# EAGLE schematic pulse-generator (EAGLE 7.6.0)

## Sheet 1 of 2
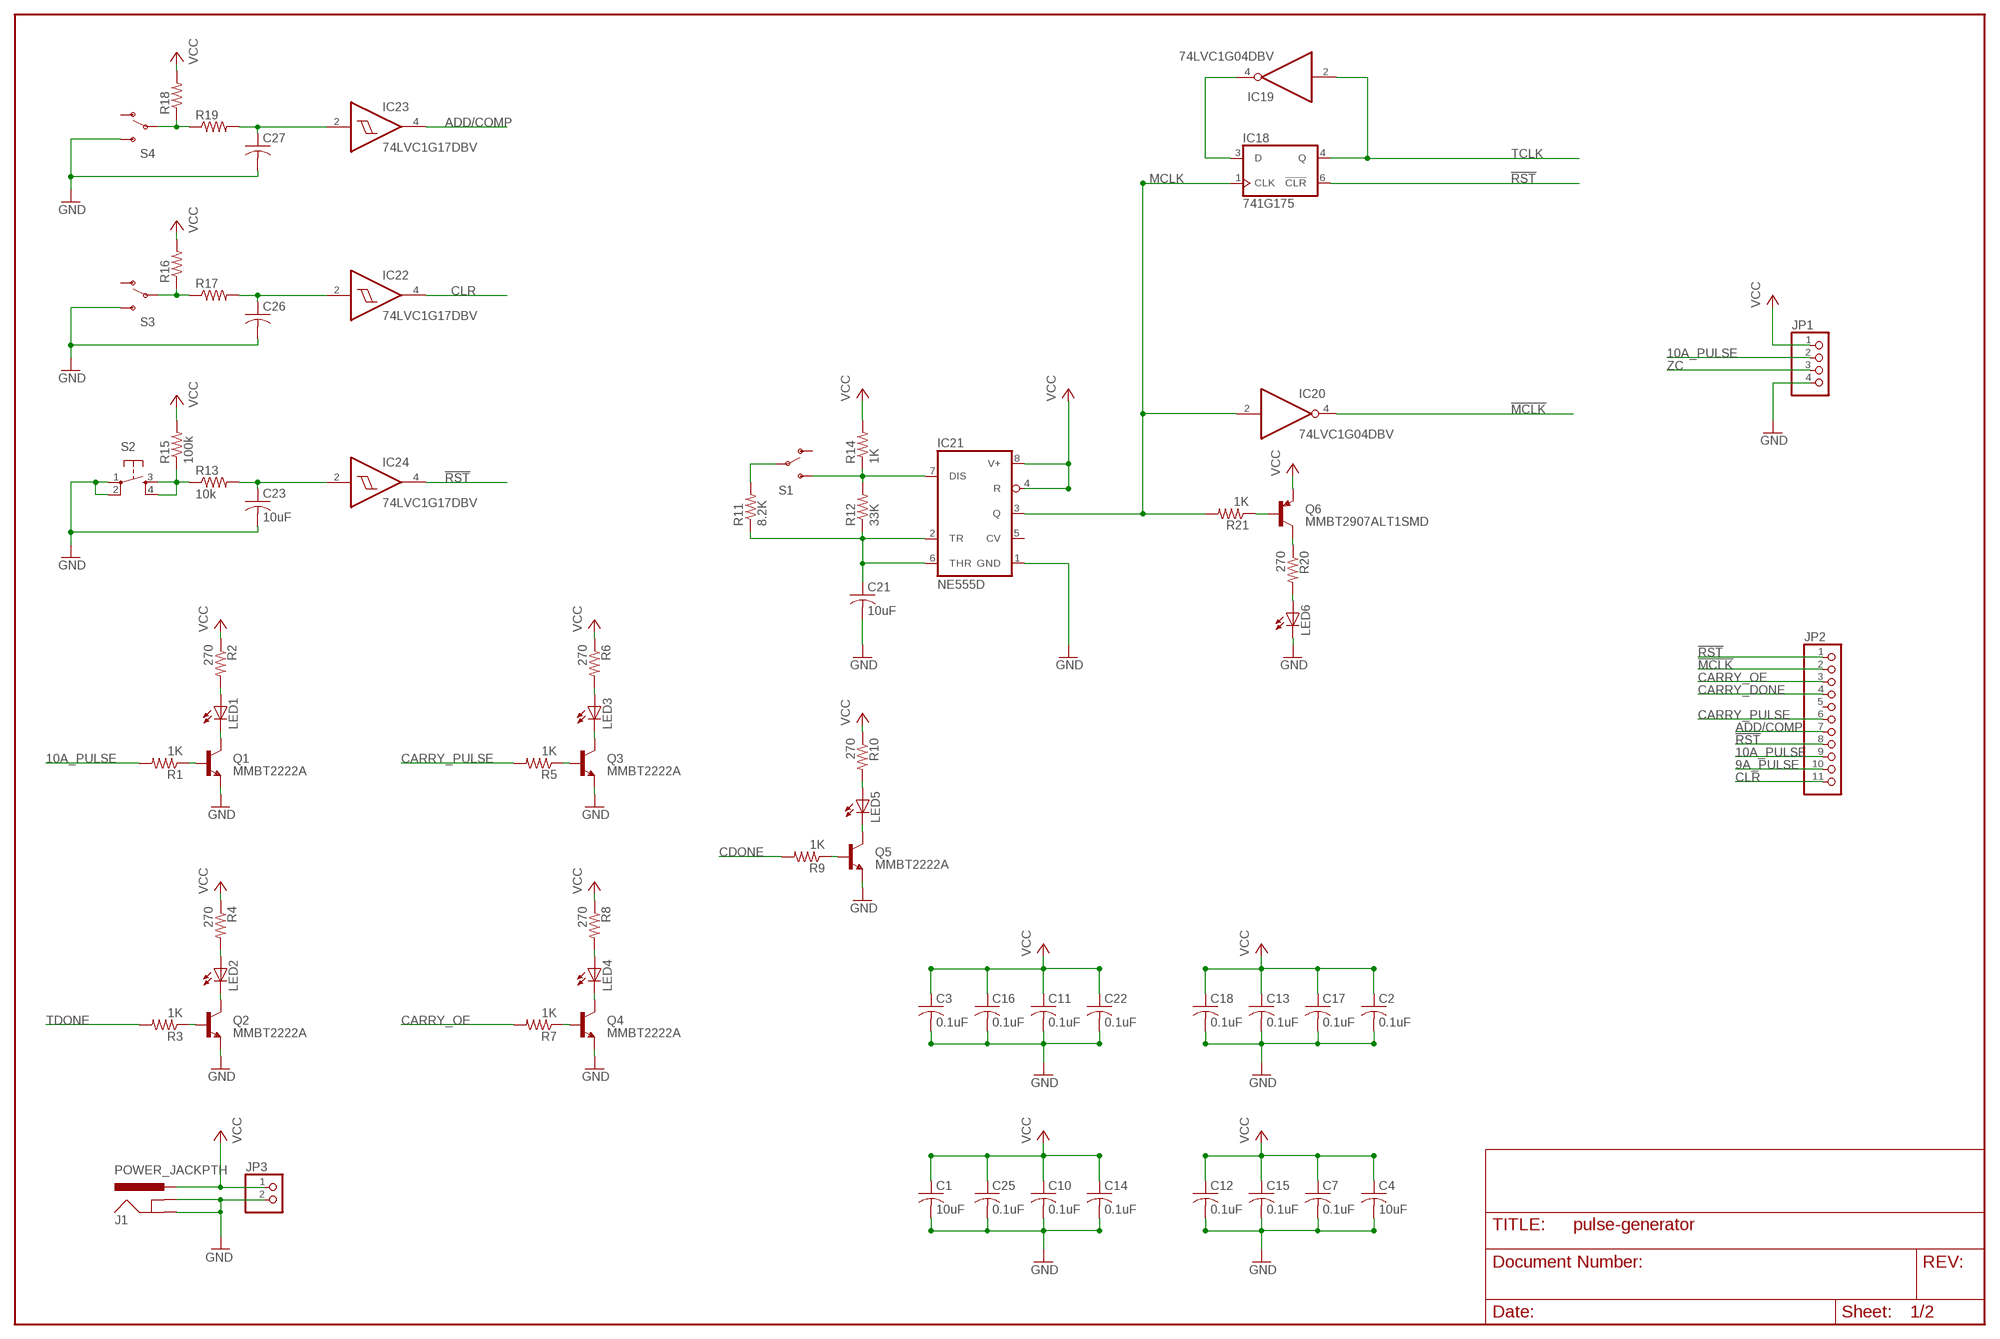
[diagram p0: schematic, sheet 1]

### Parts
C1  10uF  C-USC0805  [C0805]
C2  0.1uF  C-USC0805  [C0805]
C3  0.1uF  C-USC0805  [C0805]
C4  10uF  C-USC0805  [C0805]
C7  0.1uF  C-USC0805  [C0805]
C10  0.1uF  C-USC0805  [C0805]
C11  0.1uF  C-USC0805  [C0805]
C12  0.1uF  C-USC0805  [C0805]
C13  0.1uF  C-USC0805  [C0805]
C14  0.1uF  C-USC0805  [C0805]
C15  0.1uF  C-USC0805  [C0805]
C16  0.1uF  C-USC0805  [C0805]
C17  0.1uF  C-USC0805  [C0805]
C18  0.1uF  C-USC0805  [C0805]
C21  10uF  C-USC0805  [C0805]
C22  0.1uF  C-USC0805  [C0805]
C23  10uF  C-USC0805  [C0805]
C25  0.1uF  C-USC0805  [C0805]
C26  C-USC0805  [C0805]
C27  C-USC0805  [C0805]
IC18  741G175  [DBV_R-PDSO-G6]
IC19  74LVC1G04DBV  [SOT23-5]
IC20  74LVC1G04DBV  [SOT23-5]
IC21  NE555D  [SO08]
IC22  74LVC1G17DBV  [SOT23-5]
IC23  74LVC1G17DBV  [SOT23-5]
IC24  74LVC1G17DBV  [SOT23-5]
J1  POWER_JACKPTH  [POWER_JACK_PTH]
JP1  PINHD-1X4  [1X04]
JP2  PINHD-1X11  [1X11]
JP3  PINHD-1X2  [1X02]
LED1  LEDCHIP-LED0805  [CHIP-LED0805]
LED2  LEDCHIP-LED0805  [CHIP-LED0805]
LED3  LEDCHIP-LED0805  [CHIP-LED0805]
LED4  LEDCHIP-LED0805  [CHIP-LED0805]
LED5  LEDCHIP-LED0805  [CHIP-LED0805]
LED6  LEDCHIP-LED0805  [CHIP-LED0805]
Q1  MMBT2222A  TRANSISTOR_NPNMMBT2222A  [SOT23-3]
Q2  MMBT2222A  TRANSISTOR_NPNMMBT2222A  [SOT23-3]
Q3  MMBT2222A  TRANSISTOR_NPNMMBT2222A  [SOT23-3]
Q4  MMBT2222A  TRANSISTOR_NPNMMBT2222A  [SOT23-3]
Q5  MMBT2222A  TRANSISTOR_NPNMMBT2222A  [SOT23-3]
Q6  MMBT2907ALT1SMD  [SOT23-BEC]
R1  1K  R-US_R0805  [R0805]
R2  270  R-US_R0805  [R0805]
R3  1K  R-US_R0805  [R0805]
R4  270  R-US_R0805  [R0805]
R5  1K  R-US_R0805  [R0805]
R6  270  R-US_R0805  [R0805]
R7  1K  R-US_R0805  [R0805]
R8  270  R-US_R0805  [R0805]
R9  1K  R-US_R0805  [R0805]
R10  270  R-US_R0805  [R0805]
R11  8.2K  R-US_R0805  [R0805]
R12  33K  R-US_R0805  [R0805]
R13  10k  R-US_R0805  [R0805]
R14  1K  R-US_R0805  [R0805]
R15  100k  R-US_R0805  [R0805]
R16  R-US_R0805  [R0805]
R17  R-US_R0805  [R0805]
R18  R-US_R0805  [R0805]
R19  R-US_R0805  [R0805]
R20  270  R-US_R0805  [R0805]
R21  1K  R-US_R0805  [R0805]
S1  SWITCH-SPDTPTH  [SWITCH-SPDT]
S2  TAC_SWITCHPTH  [TACTILE-PTH]
S3  SWITCH-SPDTPTH  [SWITCH-SPDT]
S4  SWITCH-SPDTPTH  [SWITCH-SPDT]

### Nets
9A_PULSE: JP2.10 ; also sheet 2
10A_PULSE: JP1.2 JP2.9 R1.2 ; also sheet 2
!MCLK: IC20.4(O) JP2.2 ; also sheet 2
!RST: IC18.6(!CLR) IC24.4(O) JP2.1 JP2.8 ; also sheet 2
ADD/COMP: IC23.4(O) JP2.7
CARRY_DONE: JP2.4 ; also sheet 2
CARRY_OE: JP2.3 R7.2 ; also sheet 2
CARRY_PULSE: JP2.6 R5.2 ; also sheet 2
CDONE: R9.2 ; also sheet 2
CLR: IC22.4(O) JP2.11
GND: C1.2 C2.2 C3.2 C4.2 C7.2 C10.2 C11.2 C12.2 C13.2 C14.2 C15.2 C16.2 C17.2 C18.2 C21.2 C22.2 C23.2 C25.2 C26.2 C27.2 IC21.1(GND) J1.GND J1.GNDBREAK JP1.4 JP3.2 LED6.C Q1.2(E) Q2.2(E) Q3.2(E) Q4.2(E) Q5.2(E) S2.1 S2.2 S3.3(S) S4.3(S) ; also sheet 2
MCLK: IC18.1(CLK) IC20.2(I) IC21.3(Q) R21.2
N$1: IC18.3(D) IC19.4(O)
N$2: C21.1 IC21.2(TR) IC21.6(THR) R11.1 R12.1
N$3: IC21.7(DIS) R12.2 R14.1 S1.3(S)
N$4: R11.2 S1.2(P)
N$5: Q6.B R21.1
N$6: Q6.C R20.1
N$7: LED6.A R20.2
N$10: LED3.C Q3.3(C)
N$13: LED1.C Q1.3(C)
N$19: C23.1 IC24.2(I) R13.2
N$20: R13.1 R15.1 S2.3 S2.4
N$21: C26.1 IC22.2(I) R17.2
N$22: R16.1 R17.1 S3.2(P)
N$24: Q3.1(B) R5.1
N$25: LED3.A R6.2
N$26: Q1.1(B) R1.1
N$28: LED1.A R2.2
N$29: C27.1 IC23.2(I) R19.2
N$30: R18.1 R19.1 S4.2(P)
N$31: LED2.C Q2.3(C)
N$32: Q2.1(B) R3.1
N$33: LED2.A R4.2
N$34: LED4.C Q4.3(C)
N$35: Q4.1(B) R7.1
N$36: LED4.A R8.2
N$37: LED5.C Q5.3(C)
N$38: Q5.1(B) R9.1
N$39: LED5.A R10.2
TCLK: IC18.4(Q) IC19.2(I) ; also sheet 2
TDONE: R3.2 ; also sheet 2
VCC: C1.1 C2.1 C3.1 C4.1 C7.1 C10.1 C11.1 C12.1 C13.1 C14.1 C15.1 C16.1 C17.1 C18.1 C22.1 C25.1 IC21.4(R) IC21.8(V+) J1.PWR JP1.1 JP3.1 Q6.E R2.1 R4.1 R6.1 R8.1 R10.1 R14.2 R15.2 R16.2 R18.2 ; also sheet 2
ZC: JP1.3 ; also sheet 2
Unconnected: IC21.5(CV) JP2.5 S1.1(O) S3.1(O) S4.1(O)

## Sheet 2 of 2
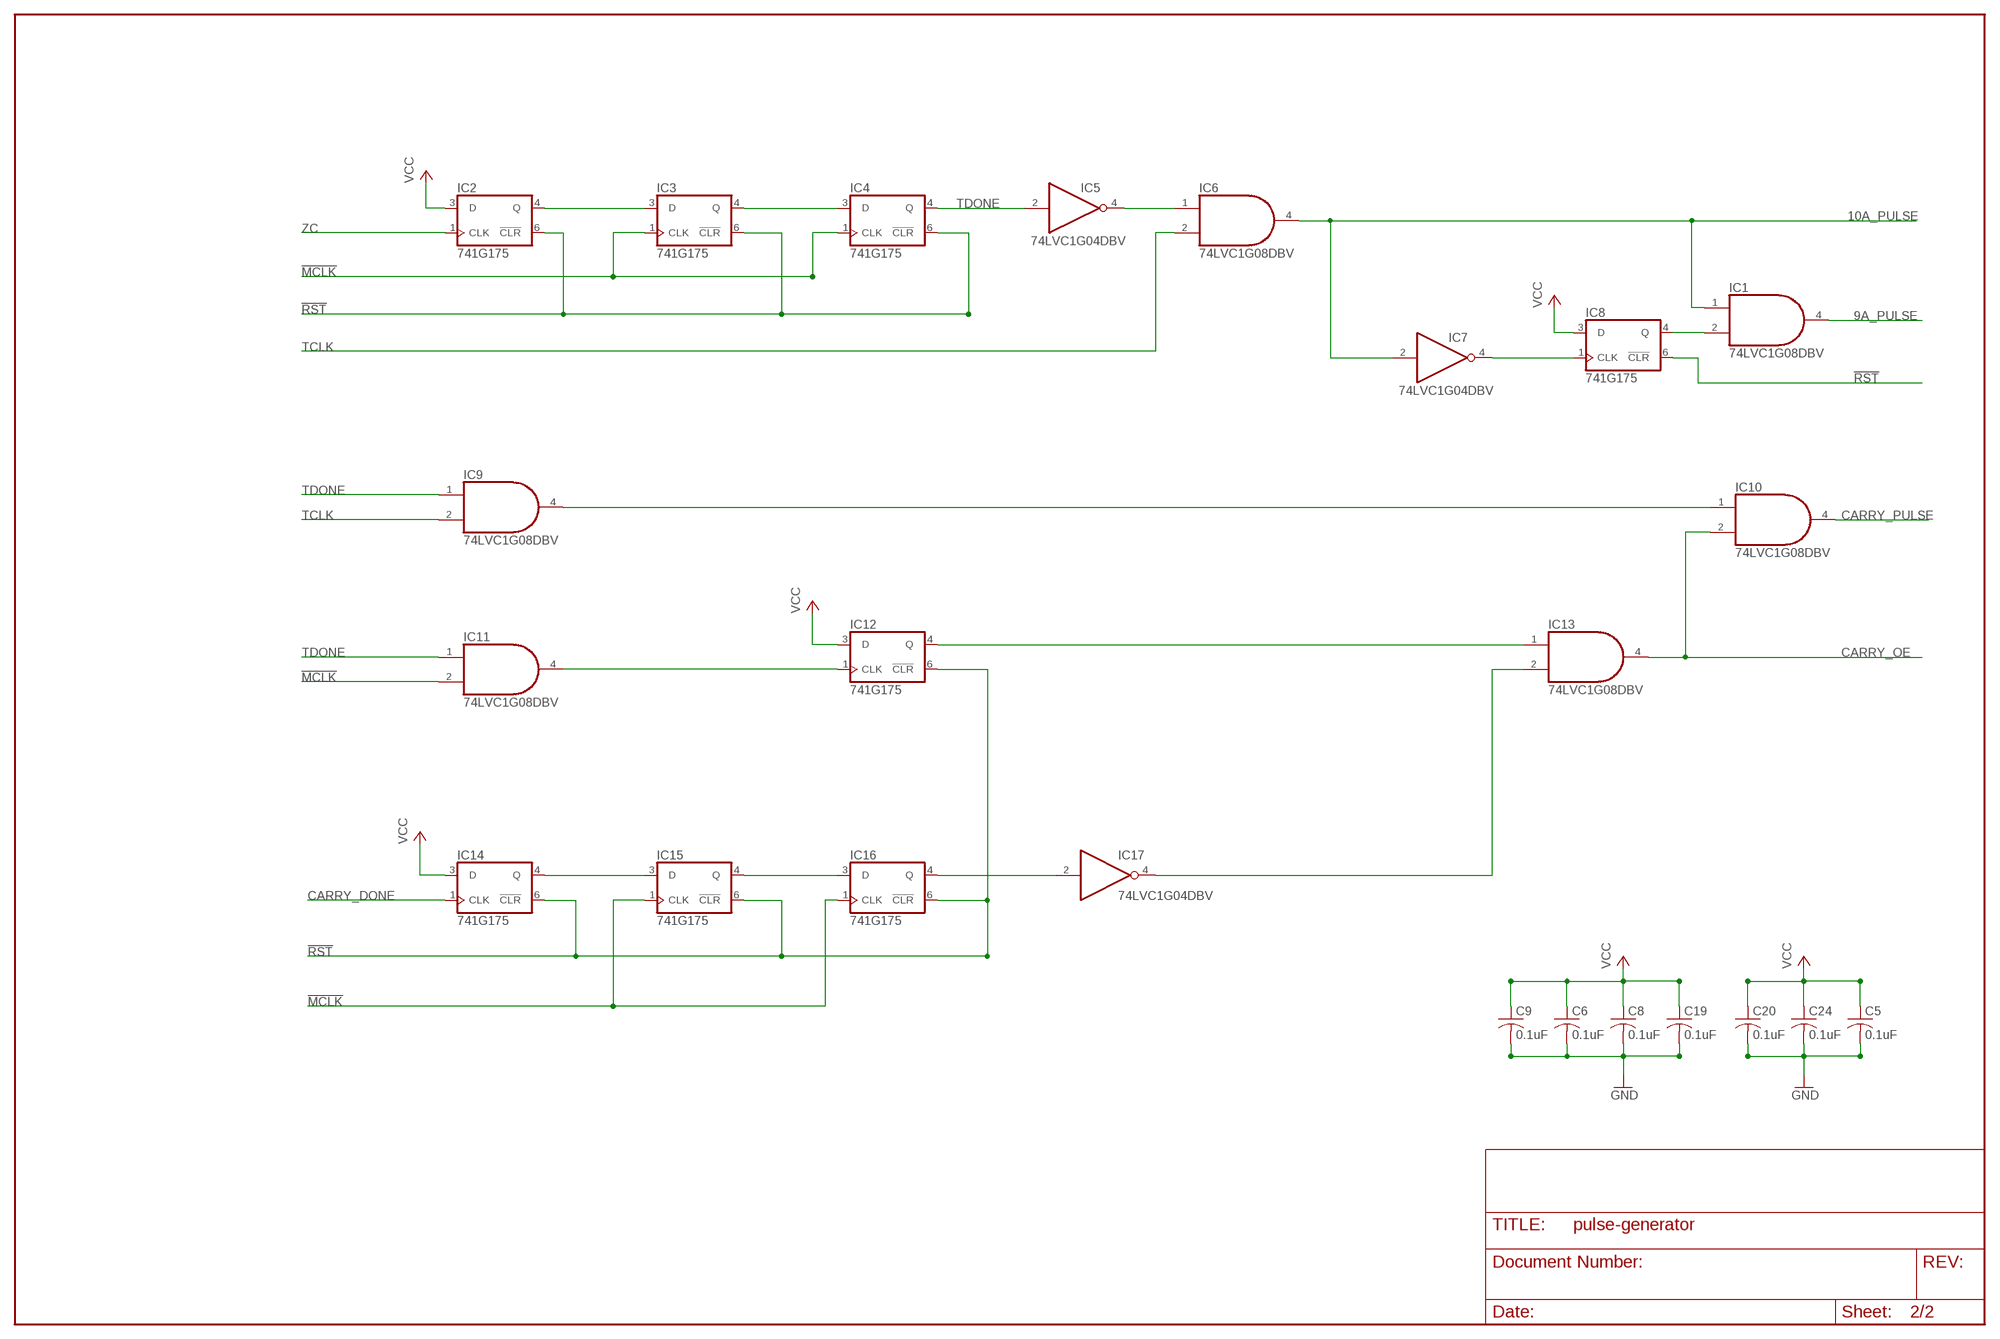
[diagram p1: schematic, sheet 2]

### Parts
C5  0.1uF  C-USC0805  [C0805]
C6  0.1uF  C-USC0805  [C0805]
C8  0.1uF  C-USC0805  [C0805]
C9  0.1uF  C-USC0805  [C0805]
C19  0.1uF  C-USC0805  [C0805]
C20  0.1uF  C-USC0805  [C0805]
C24  0.1uF  C-USC0805  [C0805]
IC1  74LVC1G08DBV  [SOT23-5]
IC2  741G175  [DBV_R-PDSO-G6]
IC3  741G175  [DBV_R-PDSO-G6]
IC4  741G175  [DBV_R-PDSO-G6]
IC5  74LVC1G04DBV  [SOT23-5]
IC6  74LVC1G08DBV  [SOT23-5]
IC7  74LVC1G04DBV  [SOT23-5]
IC8  741G175  [DBV_R-PDSO-G6]
IC9  74LVC1G08DBV  [SOT23-5]
IC10  74LVC1G08DBV  [SOT23-5]
IC11  74LVC1G08DBV  [SOT23-5]
IC12  741G175  [DBV_R-PDSO-G6]
IC13  74LVC1G08DBV  [SOT23-5]
IC14  741G175  [DBV_R-PDSO-G6]
IC15  741G175  [DBV_R-PDSO-G6]
IC16  741G175  [DBV_R-PDSO-G6]
IC17  74LVC1G04DBV  [SOT23-5]

### Nets
9A_PULSE: IC1.4(O) ; also sheet 1
10A_PULSE: IC1.1(I0) IC6.4(O) IC7.2(I) ; also sheet 1
!CDONE: IC13.2(I1) IC17.4(O)
!MCLK: IC3.1(CLK) IC4.1(CLK) IC11.2(I1) IC15.1(CLK) IC16.1(CLK) ; also sheet 1
!RST: IC2.6(!CLR) IC3.6(!CLR) IC4.6(!CLR) IC8.6(!CLR) IC12.6(!CLR) IC14.6(!CLR) IC15.6(!CLR) IC16.6(!CLR) ; also sheet 1
!TDONE: IC5.4(O) IC6.1(I0)
CARRY_DONE: IC14.1(CLK) ; also sheet 1
CARRY_OE: IC10.2(I1) IC13.4(O) ; also sheet 1
CARRY_PULSE: IC10.4(O) ; also sheet 1
CDONE: IC16.4(Q) IC17.2(I) ; also sheet 1
GND: C5.2 C6.2 C8.2 C9.2 C19.2 C20.2 C24.2 ; also sheet 1
N$8: IC2.4(Q) IC3.3(D)
N$9: IC9.4(O) IC10.1(I0)
N$11: IC14.4(Q) IC15.3(D)
N$12: IC1.2(I1) IC8.4(Q)
N$14: IC3.4(Q) IC4.3(D)
N$15: IC12.4(Q) IC13.1(I0)
N$16: IC11.4(O) IC12.1(CLK)
N$17: IC15.4(Q) IC16.3(D)
N$23: IC7.4(O) IC8.1(CLK)
TCLK: IC6.2(I1) IC9.2(I1) ; also sheet 1
TDONE: IC4.4(Q) IC5.2(I) IC9.1(I0) IC11.1(I0) ; also sheet 1
VCC: C5.1 C6.1 C8.1 C9.1 C19.1 C20.1 C24.1 IC2.3(D) IC8.3(D) IC12.3(D) IC14.3(D) ; also sheet 1
ZC: IC2.1(CLK) ; also sheet 1

## Power pins joined to a net without a drawn wire
GND: IC1.3(GND) IC2.2(GND) IC3.2(GND) IC4.2(GND) IC5.3(GND) IC6.3(GND) IC7.3(GND) IC8.2(GND) IC9.3(GND) IC10.3(GND) IC11.3(GND) IC12.2(GND) IC13.3(GND) IC14.2(GND) IC15.2(GND) IC16.2(GND) IC17.3(GND) IC18.2(GND) IC19.3(GND) IC20.3(GND) IC22.3(GND) IC23.3(GND) IC24.3(GND)
VCC: IC1.5(VCC) IC2.5(VCC) IC3.5(VCC) IC4.5(VCC) IC5.5(VCC) IC6.5(VCC) IC7.5(VCC) IC8.5(VCC) IC9.5(VCC) IC10.5(VCC) IC11.5(VCC) IC12.5(VCC) IC13.5(VCC) IC14.5(VCC) IC15.5(VCC) IC16.5(VCC) IC17.5(VCC) IC18.5(VCC) IC19.5(VCC) IC20.5(VCC) IC22.5(VCC) IC23.5(VCC) IC24.5(VCC)

## Library data of the parts
C1-C27 = resistor:C-US: CAPACITOR, American symbol
IC1 IC6 IC9-IC11 IC13 = 74xx-little-us:74*1G08: 2-input AND gate
IC2-IC4 IC8 IC12 IC14-IC16 IC18 = witch-e:74*1G175
IC5 IC7 IC17 IC19 IC20 = 74xx-little-us:74*1G04: INVERTER Gate
IC21 = adafruit:*555: TIMER Changed DIP package to have round (not oval) pin pads http://www.ladyada.net/library/pcb/eaglelibrary.html
IC22-IC24 = 74xx-little-us:74*1G17: Single Schmitt-Trigger Buffer
J1 = SparkFun-Connectors:POWER_JACK: Power Jack This is the standard 5.5mm barrel jack for power. The PTH is the most common, proven, reliable, footprint. The Slot footprint only works if the mill layer is transmitted to the PCB fab house so be warned. Mating wall wart : TOL-00298 (and others); PROD_ID: PRT-00119
JP1 = pinhead:PINHD-1X4: PIN HEADER
JP2 = pinhead:PINHD-1X11: PIN HEADER
JP3 = pinhead:PINHD-1X2: PIN HEADER
LED1-LED6 = led:LED: LED OSRAM: - CHIPLED LG R971, LG N971, LY N971, LG Q971, LY Q971, LO R971, LY R971 LH N974, LH R974 LS Q976, LO Q976, LY Q976 LO Q996 - Hyper CHIPLED LW Q18S LB Q993, LB Q99A, LB R99A - SideLED LS A670, LO A670, LY A670, LG A670, LP A670 LB A673, LV A673, LT A673, LW A673 LH A674 LY A675 LS A676, LA A676, LO A676, LY A676, LW A676 LS A679, LY A679, LG A679 - Hyper Micro SIDELED® LS Y876, LA Y876, LO Y876, LY Y876 LT Y87S - SmartLED LW L88C, LW L88S LB L89C, LB L89S, LG L890 LS L89K, LO L89K, LY L89K LS L896, LA L896, LO L896, LY L896 - TOPLED LS T670, LO T670, LY T670, LG T670, LP T670 LSG T670, LSP T670, LSY T670, LOP T670, LYG T670 LG T671, LOG T671, LSG T671 LB T673, LV T673, LT T673, LW T673 LH T674 LS T676, LA T676, LO T676, LY T676, LB T676, LH T676, LSB T676, LW T676 LB T67C, LV T67C, LT T67C, LS T67K, LO T67K, LY T67K, LW E67C LS E67B, LA E67B, LO E67B, LY E67B, LB E67C, LV E67C, LT E67C LW T67C LS T679, LY T679, LG T679 LS T770, LO T770, LY T770, LG T770, LP T770 LB T773, LV T773, LT T773, LW T773 LH T774 LS E675, LA E675, LY E675, LS T675 LS T776, LA T776, LO T776, LY T776, LB T776 LHGB T686 LT T68C, LB T68C - Hyper Mini TOPLED® LB M676 - Mini TOPLED Santana® LG M470 LS M47K, LO M47K, LY M47K Source: http://www.osram.convergy.de LUXEON: - LUMILED® LXK2-PW12-R00, LXK2-PW12-S00, LXK2-PW14-U00, LXK2-PW14-V00 LXK2-PM12-R00, LXK2-PM12-S00, LXK2-PM14-U00 LXK2-PE12-Q00, LXK2-PE12-R00, LXK2-PE12-S00, LXK2-PE14-T00, LXK2-PE14-U00 LXK2-PB12-K00, LXK2-PB12-L00, LXK2-PB12-M00, LXK2-PB14-N00, LXK2-PB14-P00, LXK2-PB14-Q00 LXK2-PR12-L00, LXK2-PR12-M00, LXK2-PR14-Q00, LXK2-PR14-R00 LXK2-PD12-Q00, LXK2-PD12-R00, LXK2-PD12-S00 LXK2-PH12-R00, LXK2-PH12-S00 LXK2-PL12-P00, LXK2-PL12-Q00, LXK2-PL12-R00 Source: www.luxeon.com KINGBRIGHT: KA-3528ASYC Source: www.kingbright.com
Q1-Q5 = SparkFun-DiscreteSemi:TRANSISTOR_NPN: Generic NPN BJT MMBT2222A - TRANS-08049 (SOT-23, 1A 40V) MPSA42 - TRANS-09116 (SOT-23, 500mA 300V) MMBT5088LT1G - TRANS-11160 (SOT-23, 50 mA 30V) BC547 - COM-08928 <http://www.sparkfun.com/products/8928> (TO-92 45V 100mA) (1.Collector 2.Base 3.Emitter) 2N3904 - COM-00521 <http://www.sparkfun.com/products/521> (TO-92 40V 200mA) (1.Emitter 2.Base 3.Collector) P2N2222A - COM-12852 <http://www.sparkfun.com/products/12852> (TO-92 40V 600mA) (1.Collector 2.Base 3.Emitter); PROD_ID: TRANS-08049
Q6 = transistor-pnp:MMBT2907*: PNP Transistror
R1-R21 = resistor:R-US_: RESISTOR, American symbol
S1 S3 S4 = SparkFun-Electromechanical:SWITCH-SPDT: SPDT Switch Simple slide switch, Spark Fun Electronics SKU : COM-00102 DPDT SMT slide switch, AYZ0202, SWCH-08179; PROD_ID: SWCH-08261
S2 = SparkFun-Electromechanical:TAC_SWITCH: Momentary Switch Button commonly used for reset or general input. Spark Fun Electronics SKU : COM-00097 SMT- SWCH-08247